# EasyEDA Pro project Pajero Gauges.epro, board PCB2
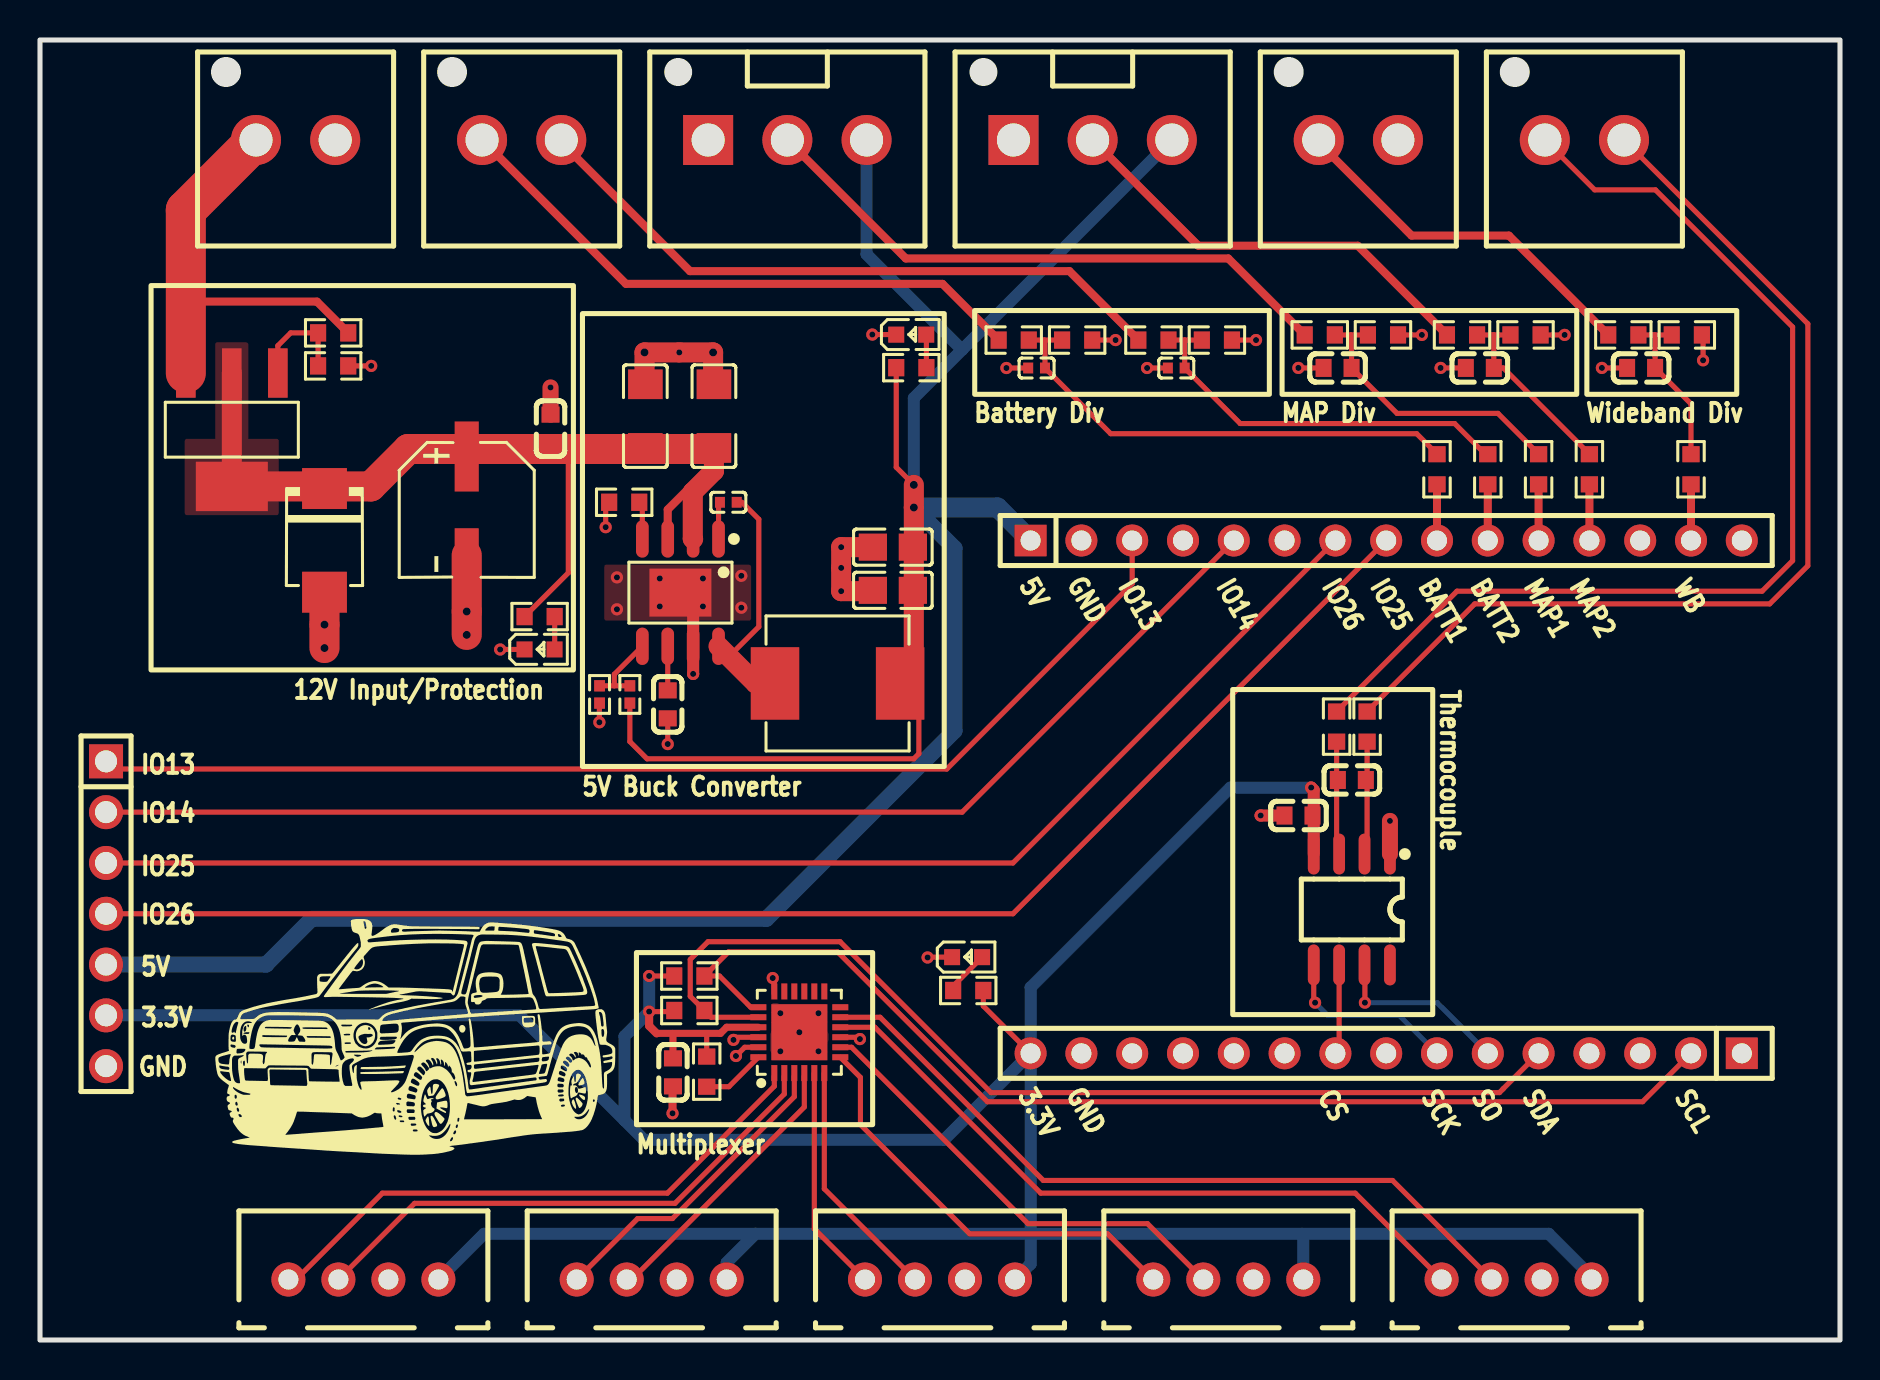
[diagram p20: board, top side]
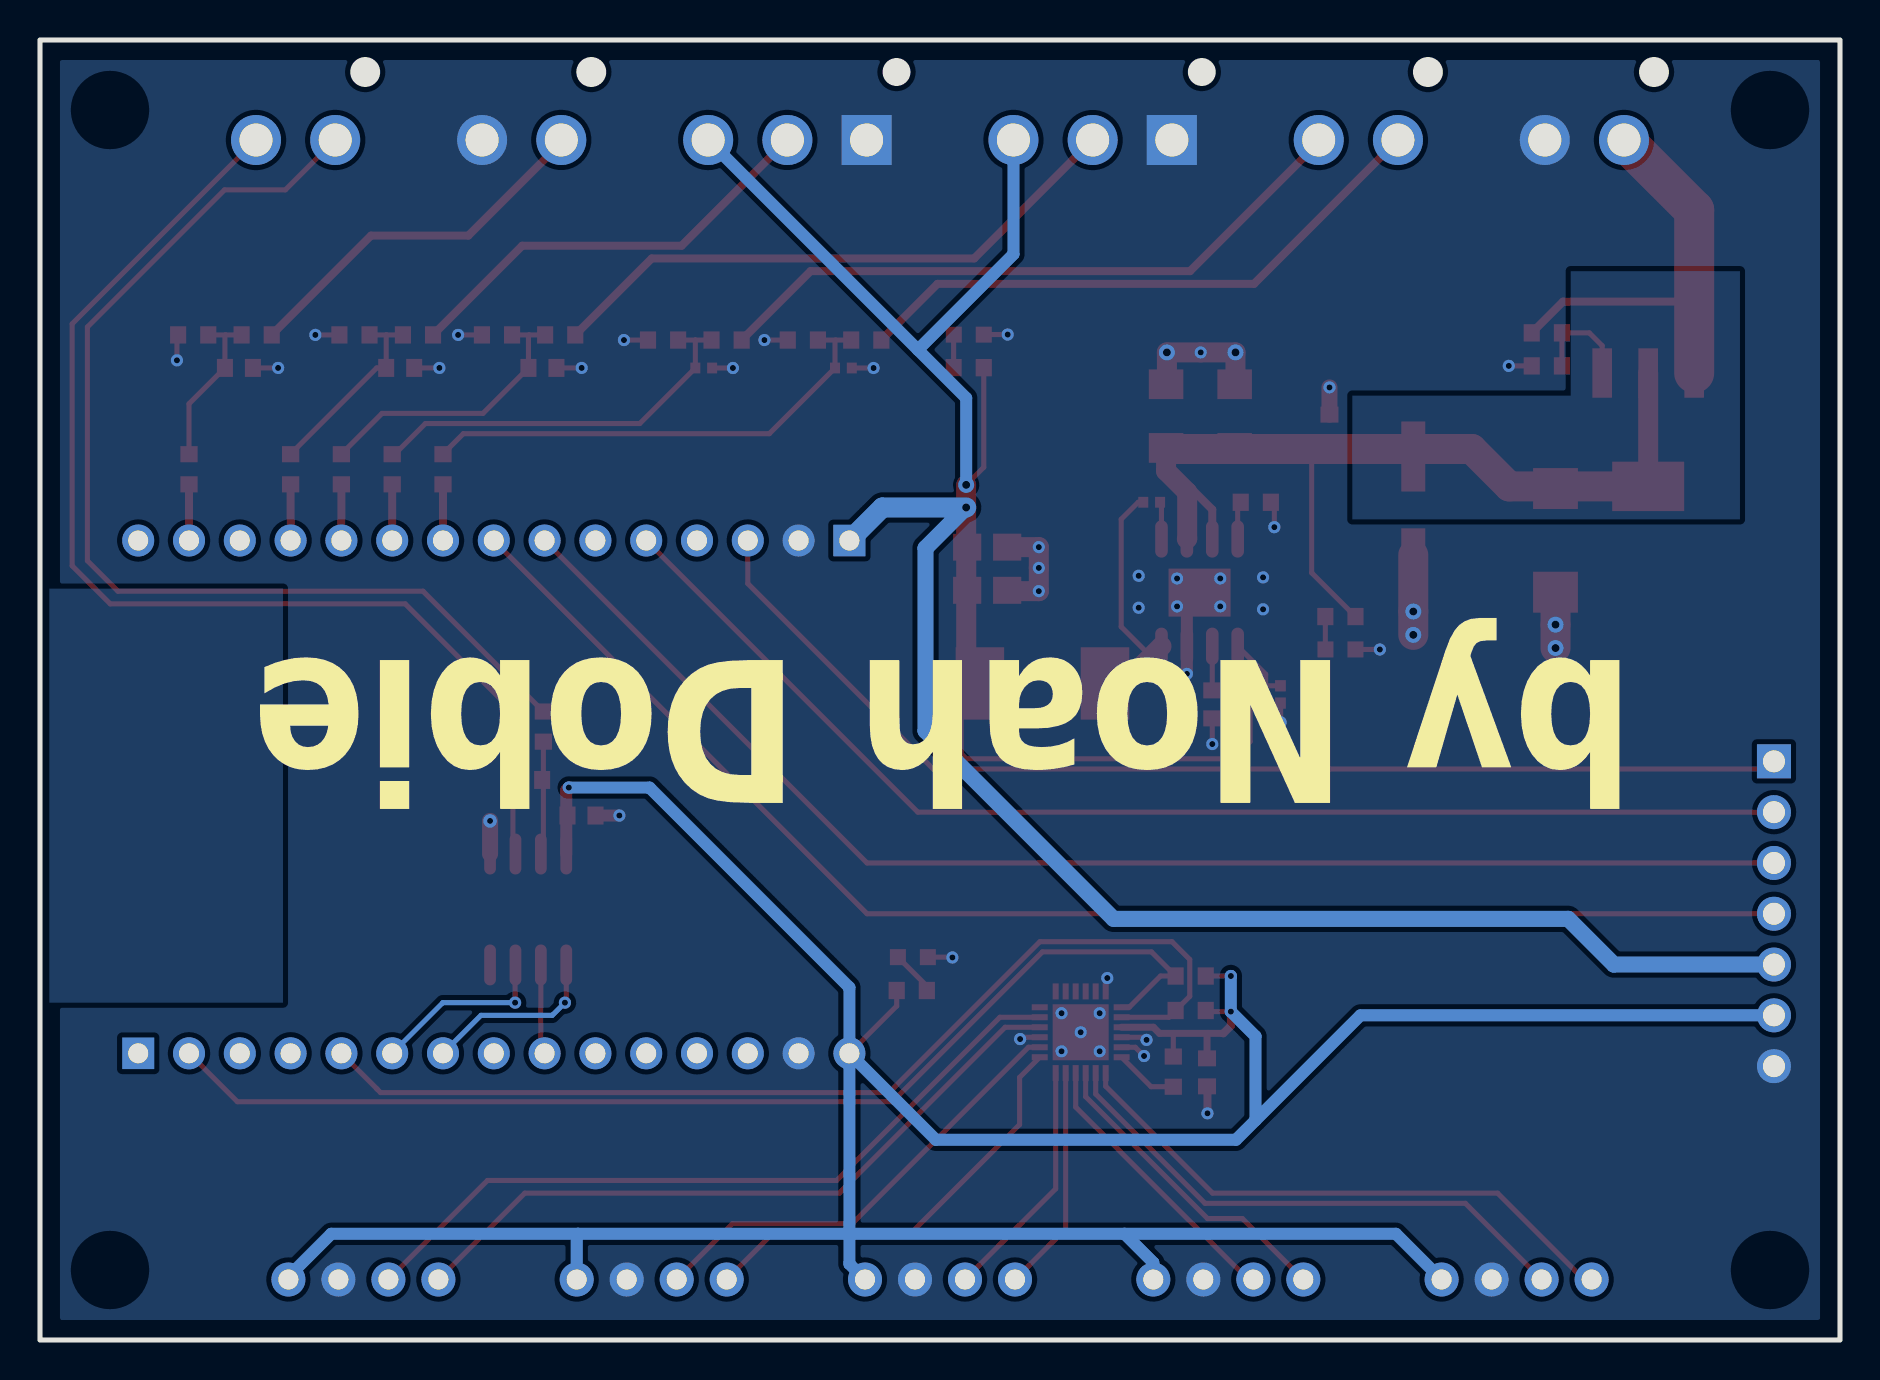
[diagram p21: board, bottom side, seen from below]

Outline 90 x 65 mm; copper layers: Top Layer, Bottom Layer. Coordinates in mm from the lower left corner of the outline.
Outline path: rectangle 0,65 90,0
Stack: Top Layer 0.035mm / Dielectric1 1.51mm FR4 er 4.5 / Bottom Layer 0.035mm

## Design rules (mm)
template: Custom Config
spacing copperThickness1oz (default): track to track 0.102, other pairs 0.152 to 0.3
spacing copperThickness2oz: track to track 0.203, other pairs 0.152 to 0.3
track width copperThickness1oz (default): min 0.127, default 0.254, max 2.54
track width copperThickness2oz: min 0.203, default 0.254, max 2.54
differential pair differentialPair (default): width min 0.127, default 0.254, max 2.54; gap min 0.152, default 0.152
via viaSize (default): diameter min 0.5, default 0.61, max 10; hole min 0.3, default 0.305, max 6.3
net PGND uses directCopper
net BATT_PROT uses directCopper
net $3N439 uses directCopper
net +5V uses directCopper

## Placement (name value [footprint] x y rotation side)
C1  100uF  [CAP-SMD_BD6.3-L6.6-W6.6-LS7.3-FD-H7.7]  21.34 41.5 270 top
C2  100nF  [C0603]  25.53 45.57 270 top
C5  100nF  [C0402]  34.42 41.89 180 top
C6  22uF  [C0805]  42.64 39.64 180 top
C7  22uF  [C0805]  42.64 37.48 180 top
C8  10nF  [C0603]  31.39 31.78 90 top
C9  47nF  [C0603]  80.06 48.6 0 top
C12  47nF  [C0603]  64.88 48.6 0 top
C14  10nF  [C0603]  65.59 28 0 top
C15  100nF  [C0603]  62.93 26.22 0 top
C50  100nF  [C0603]  31.65 13.38 270 top
C51  10uF  [C1206]  33.7 46.19 270 top
C52  10uF  [C1206]  30.27 46.19 270 top
C67  100nF  [C0402]  49.83 48.6 180 top
C69  100nF  [C0402]  56.81 48.6 180 top
C70  47nF  [C0603]  71.99 48.6 0 top
D1  SMBJ18A-Q  [SMB_L4.3-W3.6-LS5.4-RD]  14.22 39.98 270 top
H1  B2P-VH-FB-B(LF)(SN)  [CONN-TH_2P-P3.96_B2P-VH-FB-B-LF-SN]  12.78 60 0 top
H3  B2P-VH-FB-B(LF)(SN)  [CONN-TH_2P-P3.96_B2P-VH-FB-B-LF-SN]  24.08 60 0 top
H4  B3P-VH-FB-B(LF)(SN)  [CONN-TH_B3P-VH-FB-B-LF-SN]  37.37 60 180 top
H5  B3P-VH-FB-B(LF)(SN)  [CONN-TH_B3P-VH-FB-B-LF-SN]  52.63 60 180 top
H6  B2P-VH-FB-B(LF)(SN)  [CONN-TH_2P-P3.96_B2P-VH-FB-B-LF-SN]  77.22 60 0 top
H7  B2P-VH-FB-B(LF)(SN)  [CONN-TH_2P-P3.96_B2P-VH-FB-B-LF-SN]  65.92 60 0 top
H8  B4B-XH-A(LF)(SN)  [CONN-TH_B4B-XH-A-LF-SN]  16.17 3.02 0 top
H9  B4B-XH-A(LF)(SN)  [CONN-TH_B4B-XH-A-LF-SN]  30.59 3.02 0 top
H10  B4B-XH-A(LF)(SN)  [CONN-TH_B4B-XH-A-LF-SN]  45 3.02 0 top
H11  B4B-XH-A(LF)(SN)  [CONN-TH_B4B-XH-A-LF-SN]  59.41 3.02 0 top
H12  B4B-XH-A(LF)(SN)  [CONN-TH_B4B-XH-A-LF-SN]  73.83 3.02 0 top
H13  HX PZ2.54-1x7P ZZ  [HDR-TH_7P-P2.54-V-M]  3.3 21.31 270 top
L1  5.6uH  [IND-SMD_L7.0-W6.6_FXL0630]  39.88 32.83 180 top
LED1  KT-0603R  [LED0603-RD]  24.98 34.53 0 top
LED4  KT-0603R  [LED0603-RD]  43.56 50.27 0 top
LED5  KT-0603R  [LED0603-RD]  46.35 19.14 0 top
Q1  NTF2955T1G  [SOT-223-4_L6.5-W3.5-P2.30-LS7.0-BR]  9.59 45.51 90 top
R1  10kΩ  [R0603]  14.66 48.7 180 top
R2  100kΩ  [R0603]  14.66 50.36 180 top
R3  10kΩ  [R0603]  79.17 50.25 180 top
R4  1kΩ  [R0603]  77.47 43.54 270 top
R5  1kΩ  [R0603]  74.93 43.54 270 top
R6  1kΩ  [R0603]  72.39 43.54 270 top
R7  1kΩ  [R0603]  69.85 43.54 270 top
R8  20kΩ  [R0603]  82.34 50.25 180 top
R9  27kΩ  [R0603]  48.69 50 180 top
R10  27kΩ  [R0603]  55.67 50 180 top
R11  5.1kΩ  [R0603]  51.86 50 180 top
R12  5.1kΩ  [R0603]  58.85 50 180 top
R13  1kΩ  [R0603]  82.55 43.54 270 top
R14  200kΩ  [R0603]  29.21 41.89 0 top
R15  115kΩ  [R0402]  29.49 32.28 270 top
R16  22.1kΩ  [R0402]  27.98 32.28 90 top
R17  10kΩ  [R0603]  63.99 50.25 180 top
R18  10kΩ  [R0603]  71.1 50.25 180 top
R19  20kΩ  [R0603]  67.15 50.25 180 top
R20  20kΩ  [R0603]  74.28 50.25 180 top
R21  100kΩ  [R0603]  66.35 30.67 270 top
R22  100kΩ  [R0603]  64.83 30.67 270 top
R23  10kΩ  [R0603]  33.34 13.42 90 top
R24  4.7kΩ  [R0603]  32.47 16.47 0 top
R25  4.7kΩ  [R0603]  32.47 18.2 0 top
RLED1  4.7kΩ  [R0603]  24.98 36.17 0 top
RLED2  1.5kΩ  [R0603]  43.56 48.62 0 top
RLED3  1kΩ  [R0603]  46.41 17.48 180 top
U1  MAX31855TASA+T  [SOIC-8_L4.9-W3.9-P1.27-LS6.2-BL]  65.59 21.53 180 top
U13  TCA9548ARGERQ1  [VQFN-24_L4.0-W4.0-P0.50-TL-EP2.8]  37.97 15.39 90 top
U18  AP64352QSP-13  [ESOP-8_L4.9-W3.9-P1.27-LS6.0-BL-EP3.1-1]  32.02 37.37 180 top
U19  HX PM2.54-1x15P ZC  [HDR-TH_15P-P2.54-V-F-1]  67.31 39.97 0 top
U20  HX PM2.54-1x15P ZC  [HDR-TH_15P-P2.54-V-F-1]  67.31 14.33 180 top

## Footprints (pads in the part's own frame, mm; a bottom-side part is the same pattern mirrored in y, then rotated)
C0402
  rect 0.5x0.54 smd: 1(-0.42,0) 2(0.42,0)
C0603
  rect 0.8x0.9 smd: 1(-0.7,0) 2(0.7,0)
C0805
  rect 1.41x1.35 smd: 1(-1,0) 2(1,0)
C1206
  rect 1.485x1.728 smd: 1(-1.593,0) 2(1.593,0)
CAP-SMD_BD6.3-L6.6-W6.6-LS7.3-FD-H7.7
  rect 3.5x1.2 smd: 1(-2.67,0) 2(2.67,0)
CONN-TH_2P-P3.96_B2P-VH-FB-B-LF-SN
  round 2.5 hole 1.65: 1(-1.98,0) 2(1.98,0)
CONN-TH_B3P-VH-FB-B-LF-SN
  rect 2.5x2.5 hole 1.65: 1(3.96,0)
  round 2.5 hole 1.65: 2(0.001,0) 3(-3.96,0)
CONN-TH_B4B-XH-A-LF-SN
  round 1.7 hole 1: 1(3.75,0) 2(1.25,0) 3(-1.25,0) 4(-3.75,0)
ESOP-8_L4.9-W3.9-P1.27-LS6.0-BL-EP3.1-1
  oval 0.63x1.865 smd: 1(-1.905,-2.683) 2(-0.635,-2.683) 3(0.635,-2.683) 4(1.905,-2.683) 5(1.905,2.683) 6(0.635,2.683) 7(-0.635,2.683) 8(-1.905,2.683)
  rect 3.1x2.4 smd: 9(0,0)
HDR-TH_7P-P2.54-V-M
  rect 1.7x1.7 hole 1.1: 1(-7.62,0)
  round 1.7 hole 1.1: 2(-5.08,0) 3(-2.54,0) 4(0,0) 5(2.54,0) 6(5.08,0) 7(7.62,0)
HDR-TH_15P-P2.54-V-F-1
  rect 1.6x1.575 hole 1: 1(-17.78,0)
  round 1.6 hole 1: 2(-15.24,0) 3(-12.7,0) 4(-10.16,0) 5(-7.62,0) 6(-5.08,0) 7(-2.54,0) 8(0,0) 9(2.54,0) 10(5.08,0) 11(7.62,0) 12(10.16,0) 13(12.7,0) 14(15.24,0) 15(17.78,0)
IND-SMD_L7.0-W6.6_FXL0630
  rect 2.424x3.62 smd: 1(3.128,0) 2(-3.128,0)
LED0603-RD
  rect 0.8x0.8 smd: 1(-0.749,0) 2(0.749,0)
R0402
  rect 0.566x0.54 smd: 1(-0.433,0) 2(0.433,0)
R0603
  rect 0.806x0.864 smd: 1(-0.753,0) 2(0.753,0)
SMB_L4.3-W3.6-LS5.4-RD
  rect 2.047x2.241 smd: 1(-2.591,0) 2(2.591,0)
SOIC-8_L4.9-W3.9-P1.27-LS6.2-BL
  oval 0.588x2.045 smd: 1(-1.905,-2.772) 2(-0.635,-2.772) 3(0.635,-2.772) 4(1.905,-2.772) 5(1.905,2.772) 6(0.635,2.772) 7(-0.635,2.772) 8(-1.905,2.772)
SOT-223-4_L6.5-W3.5-P2.30-LS7.0-BR
  rect 2.47x0.98 smd: 1(2.835,-2.3) 2(2.835,0) 3(2.835,2.3)
  rect 2.47x3.6 smd: 4(-2.835,0)
VQFN-24_L4.0-W4.0-P0.50-TL-EP2.8
  rect 0.8x0.3 smd: 1(-2.042,1.25) 2(-2.042,0.75) 3(-2.042,0.25) 4(-2.042,-0.25) 5(-2.042,-0.75) 6(-2.042,-1.25) 13(2.042,-1.25) 14(2.042,-0.75) 15(2.042,-0.25) 16(2.042,0.25) 17(2.042,0.75) 18(2.042,1.25)
  rect 0.3x0.8 smd: 7(-1.25,-2.048) 8(-0.75,-2.048) 9(-0.25,-2.048) 10(0.249,-2.048) 11(0.75,-2.048) 12(1.25,-2.048) 19(1.25,2.048) 20(0.75,2.048) 21(0.249,2.048) 22(-0.25,2.048) 23(-0.75,2.048) 24(-1.25,2.048)
  rect 2.8x2.8 smd: 25(-0.001,-0.001)

## Nets
As in the schematic.

Pads without a net: U1 8; U13 12 13 14 15 16 17; U19 4 6 13 15; U20 1 3 4 8 10 11 12 13

## Via types
v1: diameter 0.8, hole 0.4, Top Layer to Bottom Layer, 8 vias
v2: diameter 0.61, hole 0.305, Top Layer to Bottom Layer, 47 vias
v3: diameter 0.68, hole 0.3, Top Layer to Bottom Layer, 1 via

## Routing (per net, layer and track width the routed paths; a pad name or vN(x,y) marks a point on that pad's centre or on a via; arc(x,y) is an arc through that point)
+3.3V: length 175.2
  Top Layer w0.254: R23.2 33.34,15.32 33.33,15.33 ; R24.1 31.66,16.42 v2(30.46,16.42) ; U20.15 47.17,16.7 RLED3.1 ; v2(30.46,18.2) R25.1
  Top Layer w0.35: 30.83,15.33 31.61,15.33 ; 31.61,15.33 31.65,15.29 C50.1 ; 31.61,15.33 34.02,15.33 34.33,15.64 U13.21
  Top Layer w0.4: 30.83,15.33 30.46,15.7 v2(30.46,16.42)
  Top Layer w0.6: U1.4 63.69,27.49 v2(63.56,27.62)
  Bottom Layer w0.6: 29.22,10.99 29.22,15.19 v2(30.46,16.42) v2(30.46,18.2) ; 29.22,10.99 30.2,10.01 45.21,10.01 U20.15 ; 29.22,10.99 23.98,16.23 H13.6 ; U20.15 49.53,17.63 59.52,27.62 v2(63.56,27.62) ; U20.15 49.53,5.31 ; H10.1 49.53,3.8 49.53,5.31 ; 49.53,5.31 63.1,5.31 ; 49.53,5.31 35.78,5.31 ; 63.1,5.31 63.16,5.24 H11.1 ; 63.1,5.31 75.44,5.31 77.58,3.17 H12.1 ; H9.1 34.34,3.87 35.78,5.31 ; 35.78,5.31 22.21,5.31 H8.1
+5V: length 138.1
  Top Layer w0.254: RLED2.1 42.81,43.64 v1(43.69,42.76) ; R15.2 29.49,29.92 30.35,29.06 43.69,29.06 43.94,29.31 43.94,31.89 L1.2
  Top Layer w1: v1(43.69,42.76) v1(43.69,41.62) 43.69,39.69 C6.1 43.69,39.6 43.69,33.51 L1.2
  Bottom Layer w0.6: H4.3 41.33,54.29 46.1,49.51 ; 46.1,49.51 43.69,47.1 v1(43.69,42.76) ; 46.1,49.51 H5.3
  Bottom Layer w0.8: H13.5 11.3,18.77 13.59,21.06 36.32,21.06 45.72,30.46 45.72,39.59 v1(43.69,41.62)
  Bottom Layer w1: U19.1 47.88,41.62 v1(43.69,41.62)
PGND: length 53.6
  Top Layer w0.254: U13.23 35.24,14.64 v2(34.8,14.2) ; v2(48.32,48.6) 49.39,48.6 ; 36.72,17.3 36.72,18.02 v2(36.64,18.1) ; v2(34.67,15.01) 34.81,15.14 U13.22 ; LED5.1 44.4,19.14 v2(44.38,19.13) ; v2(41,15.05) 40.9,15.14 U13.9 ; v2(53.78,50) R11.1 ; v2(55.35,48.6) 56.42,48.6 ; v2(23.01,34.53) 23.01,34.53 LED1.1 ; v2(76.23,50.25) 75.04,50.25 ; v2(60.8,50) 59.61,50 ; LED4.1 42.81,50.27 v2(41.62,50.27) ; v2(70.03,48.6) 71.22,48.6 ; 83.1,50.25 83.15,50.21 v2(83.15,48.98) ; v2(28.28,40.64) 28.28,41.88 28.32,41.91 ; R16.1 27.97,31.83 v2(27.97,30.89) ; R1.1 v2(16.56,48.7) ; v2(62.92,48.6) 64.11,48.6 ; v2(78.09,48.6) 79.29,48.6 ; C8.1 v2(31.39,29.8) ; v2(69.09,50.25) R19.1
  Top Layer w0.4: v2(31.63,11.33) 31.63,12.66 31.65,12.68
  Top Layer w0.6: v2(61.03,26.22) 62.22,26.22 ; U18.9 32.66,36.73 U18.7 v2(32.66,33.31)
  Top Layer w0.8: U1.1 v3(67.5,25.95) ; C2.1 v2(25.53,47.63)
  Top Layer w1: 33.7,47.58 33.66,47.63 v1(33.66,49.38) v2(31.96,49.38) v1(30.23,49.38) 30.23,47.63 30.27,47.58 ; C6.2 v2(40.06,39.64) v2(40.06,38.61) v2(40.06,37.44) 41.6,37.44 C7.2
  Top Layer w1.5: 21.34,39.25 v1(21.34,36.42) v1(21.34,35.26) ; D1.2 v1(14.22,35.77) v1(14.22,34.6)
  vias: v2(28.85,38.13) v2(28.85,36.53) v2(30.99,38.08) v2(30.99,36.68) v2(33.15,38.08) v2(33.15,36.68) v2(35.07,38.21) v2(35.07,36.61) v2(37.02,16.34) v2(37.02,14.43) v2(37.97,15.39) v2(38.92,16.34) v2(38.92,14.43)
BATT1_IN: length 30
  Top Layer w0.4: H3.1 29.3,52.81 45.12,52.81 R9.2
BATT1_STPDWN: length 24.6
  Top Layer w0.254: 50.22,50 50.25,49.97 C67.1 53.53,45.31 68.83,45.31 69.85,44.3 69.85,44.16 ; 50.22,50 R11.2 ; 50.22,50 R9.1
BATT2_IN: length 33.1
  Top Layer w0.4: H3.2 26.06,59.88 32.5,53.44 51.47,53.44 R10.2
BATT2_STPDWN: length 20.1
  Top Layer w0.254: 57.23,50 R12.2 ; 57.23,50 R10.1 ; 57.23,50 57.23,49.99 C69.1 60.01,45.82 70.73,45.82 72.39,44.16
BATT_PROT: length 48.7
  Top Layer w0.254: RLED1.1 26.42,38.36 26.42,44.05
  Top Layer w0.4: 33.27,43.41 31.39,41.52 U18.3
  Top Layer w1: 33.7,44.55 33.7,43.45 32.64,42.39 32.64,40.07 U18.2 ; Q1.2 Q1.4
  Top Layer w1.5: 21.11,44.55 18.41,44.55 16.54,42.68 Q1.4 ; 21.11,44.55 33.7,44.55 ; 21.11,44.55 21.34,44.77
GPIO13: length 57.5
  Top Layer w0.254: H13.1 3.68,28.55 45.34,28.55 54.61,37.82 U19.3
GPIO14: length 62
  Top Layer w0.254: U19.5 46.11,26.39 H13.2
GPIO25: length 71.7
  Top Layer w0.254: U19.8 48.65,21.31 H13.4
GPIO26: length 68.1
  Top Layer w0.254: U19.7 48.65,23.85 H13.3
IGN_12V: length 21.3
  Top Layer w0.4: 7.87,51.92 13.85,51.92 R2.1
  Top Layer w2: H1.1 7.29,56.49 Q1.3
MAP1_SIGNAL_OUT: length 29.9
  Top Layer w0.4: H4.2 43.29,54.08 59.41,54.08 R17.2
MAP1_STPDWN: length 14.6
  Top Layer w0.254: 65.55,50.25 65.58,50.22 C12.2 67.85,46.33 72.9,46.33 74.93,44.3 74.93,44.16 ; 65.55,50.25 R19.2 ; 65.55,50.25 64.74,50.25
MAP2_SIGNAL_OUT: length 21.8
  Top Layer w0.4: H5.2 57.92,54.71 65.89,54.71 R18.2
MAP2_STPDWN: length 10
  Top Layer w0.254: 71.85,50.25 72.68,50.25 ; 72.68,50.25 R20.2 ; 72.68,50.25 72.69,50.24 C70.2 73.17,48.6 77.47,44.3 77.47,44.16
MOS_G: length 5.3
  Top Layer w0.254: R1.2 R2.2 12.53,50.36 11.89,49.71 11.89,48.35
MUX_RESET: length 3.2
  Top Layer w0.254: U13.24 34.44,12.67 R23.1
MUX_SCL: length 57.3
  Top Layer w0.254: U13.19 35.54,16.64 33.97,18.2 R25.2 34.43,19.41 39.88,19.41 47.37,11.91 80.13,11.91 U20.2
MUX_SDA: length 52.4
  Top Layer w0.254: U20.5 73.15,12.56 73.15,12.55 72.97,12.37 47.55,12.37 40,19.92 33.4,19.92 32.51,19.03 32.51,17.18 R24.2 33.56,16.14 U13.20
OLED1_SCL: length 27.1
  Top Layer w0.254: H8.3 18.73,6.83 31.75,6.83 37.22,12.3 37.22,13.22
OLED1_SDA: length 28.8
  Top Layer w0.254: H8.4 12.8,3.02 17.12,7.34 31.37,7.34 36.72,12.69 36.72,13.22
OLED2_SCL: length 14
  Top Layer w0.254: H9.3 29.59,3.02 38.22,11.65 38.22,13.22
OLED2_SDA: length 15.7
  Top Layer w0.254: H9.4 29.88,6.07 31.62,6.07 37.72,12.17 37.72,13.22
OLED3_SCL: length 12.2
  Top Layer w0.254: H10.3 39.22,7.56 U13.6
OLED3_SDA: length 11.4
  Top Layer w0.254: U13.5 38.72,5.56 H10.4
OLED4_SCL: length 23
  Top Layer w0.254: H11.3 55.37,5.82 49.4,5.82 40.58,14.64 U13.8
OLED4_SDA: length 21.6
  Top Layer w0.254: U13.7 41.02,13.13 41.02,10.77 46.48,5.31 53.38,5.31 H11.4
OLED5_SCL: length 38
  Top Layer w0.254: H12.3 67.63,7.98 50.16,7.98 42,16.14 U13.11
OLED5_SDA: length 35.3
  Top Layer w0.254: U13.10 41.74,15.64 50.04,7.34 65.76,7.34 H12.4
TC+: length 53.9
  Top Layer w0.254: 64.83,31.42 70.85,37.44 86.11,37.44 87.63,38.97 87.63,50.65 80.77,57.51 77.73,57.51 H6.1
TC+AFTERPULLUP: length 5.7
  Top Layer w0.254: R22.2 64.83,24.42 64.96,24.3
TC-: length 50.2
  Top Layer w0.254: 66.35,31.42 71.74,36.81 86.49,36.81 88.39,38.71 88.39,50.81 H6.2
TC-AFTERPULLUP: length 5.7
  Top Layer w0.254: R21.2 66.35,24.42 U1.2
TC_CS: length 4.5
  Top Layer w0.254: 64.96,18.75 64.96,14.52 U20.9
TC_SCK: length 9.1
  Top Layer w0.254: U1.5 63.69,16.93 v2(63.75,16.87)
  Bottom Layer w0.254: v2(63.75,16.87) 64.39,16.23 67.95,16.23 U20.7
TC_SO: length 9.1
  Top Layer w0.254: v2(66.25,16.87) 66.25,18.73 U1.7
  Bottom Layer w0.254: U20.6 69.86,16.87 v2(66.25,16.87)
WB_OUT: length 18.6
  Top Layer w0.4: H7.1 63.94,59.86 68.58,55.22 73.45,55.22 R3.2
WB_STPDWN: length 8.5
  Top Layer w0.254: 82.55,44.16 82.55,46.81 C9.2 80.75,50.22 80.72,50.25 ; 80.72,50.25 R8.2 ; 80.72,50.25 R3.1
$1N464: length 2.7
  Top Layer w0.4: 69.85,42.66 U19.9
$1N467: length 2.7
  Top Layer w0.4: 72.39,42.66 U19.10
$1N468: length 2.7
  Top Layer w0.4: 74.93,42.66 U19.11
$1N472: length 2.7
  Top Layer w0.4: 82.55,42.66 U19.14
$1N473: length 2.7
  Top Layer w0.4: 77.47,42.66 U19.12
$1N1205: length 2.3
  Top Layer w0.254: RLED3.2 45.66,17.7 47.1,19.14
$2N754: length 1.6
  Top Layer w0.254: LED1.2 25.73,34.54 RLED1.2
$3N360: length 1.9
  Top Layer w0.254: R14.2 30.12,41.73 U18.4
$3N439: length 12.2
  Top Layer w0.254: C5.1 35.09,41.89 35.94,41.04 35.94,35.66 34.67,34.39
  Top Layer w1: U18.8 35.79,32.83 L1.1
$3N491: length 1.9
  Top Layer w0.254: C5.2 33.93,41.82 U18.1
$3N614: length 2.2
  Top Layer w0.254: U18.6 31.39,32.48
$3N629: length 4.1
  Top Layer w0.254: 27.98,32.71 28.72,32.71 ; 28.72,32.71 28.72,33.29 U18.5 ; 28.72,32.71 29.49,32.71
$3N1561: length 1.7
  Top Layer w0.254: RLED2.2 44.32,50.26 LED4.2

## Copper pours and planes (outline as drawn; the poured copper is in the pictures)
PGND on Top Layer: 35.58,38.77 35.58,35.97 28.21,35.97 28.21,38.77
PGND on Top Layer: 36.51,13.93 36.51,16.85 39.43,16.85 39.43,13.93
PGND on Bottom Layer: 1,64 89,64 89,1 1,1
(no net) on Bottom Layer: 77.85,37.57 89.53,37.57 89.53,16.87 77.85,16.87
(no net) on Bottom Layer: 5,53.44 24.38,53.44 24.38,41.03 5,41.03
BATT_PROT on Top Layer: 8.76,49.89 10.41,49.89 10.41,45.06 11.94,45.06 11.94,41.25 7.25,41.25 7.24,41.25 7.24,45.06 8.76,45.06

## Text on the board
Bottom Silkscreen Layer: by Noah Dobie
Top Silkscreen Layer: 3.3V | 5V | GND | IO13 | IO14 | CS | IO26 | IO25 | BATT1 | SCK | BATT2 | SO | SDA | MAP1 | MAP2 | WB | SCL | 12V Input/Protection | 5V Buck Converter | Battery Div | MAP Div | Wideband Div | Thermocouple | Multiplexer
